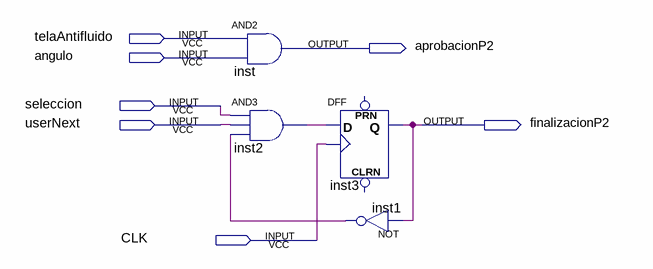
[diagram p0: schematic sheet]
// Quartus schematic procesoDos.bdf as structural Verilog: 4 symbols, 7 pins
module procesoDos (
  input  telaAntifluido,
  input  angulo,
  input  seleccion,
  input  userNext,
  input  CLK,
  output aprobacionP2,
  output finalizacionP2
);

  wire inst1_out, inst2_out;

  and inst (aprobacionP2, telaAntifluido, angulo);
  and inst2 (inst2_out, seleccion, userNext, inst1_out);
  DFF inst3 (.CLK(CLK), .D(inst2_out), .Q(finalizacionP2));  // open: CLRN, PRN
  not inst1 (inst1_out, finalizacionP2);
endmodule
